# Altium schematic sheet sar20-baseboard.SchDoc
size A4
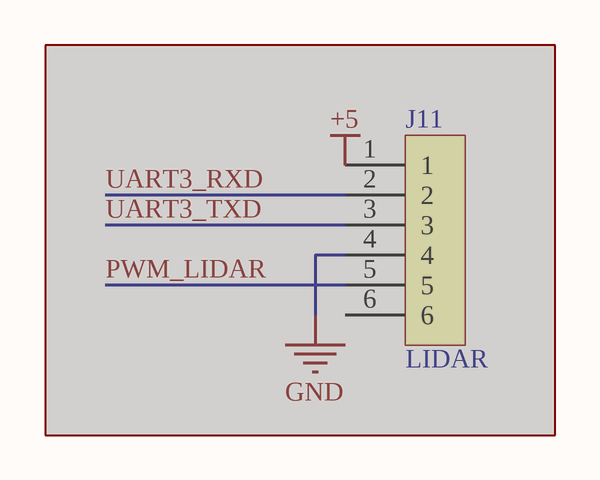
[diagram p0: sar20-baseboard.SchDoc]

## Parts
J11  LIDAR  [MICRO-MATCH-FOB-SMD-06]  (masked out: inside a compile mask, not in the netlist)

## Library data of the parts
J11 = HEADER-6